# Altium schematic sheet APP_1_Power_m.SchDoc
size Tabloid; SheetNumber: 10; SheetTotal: 16; Sheet_Name: Power; Size: 11x17
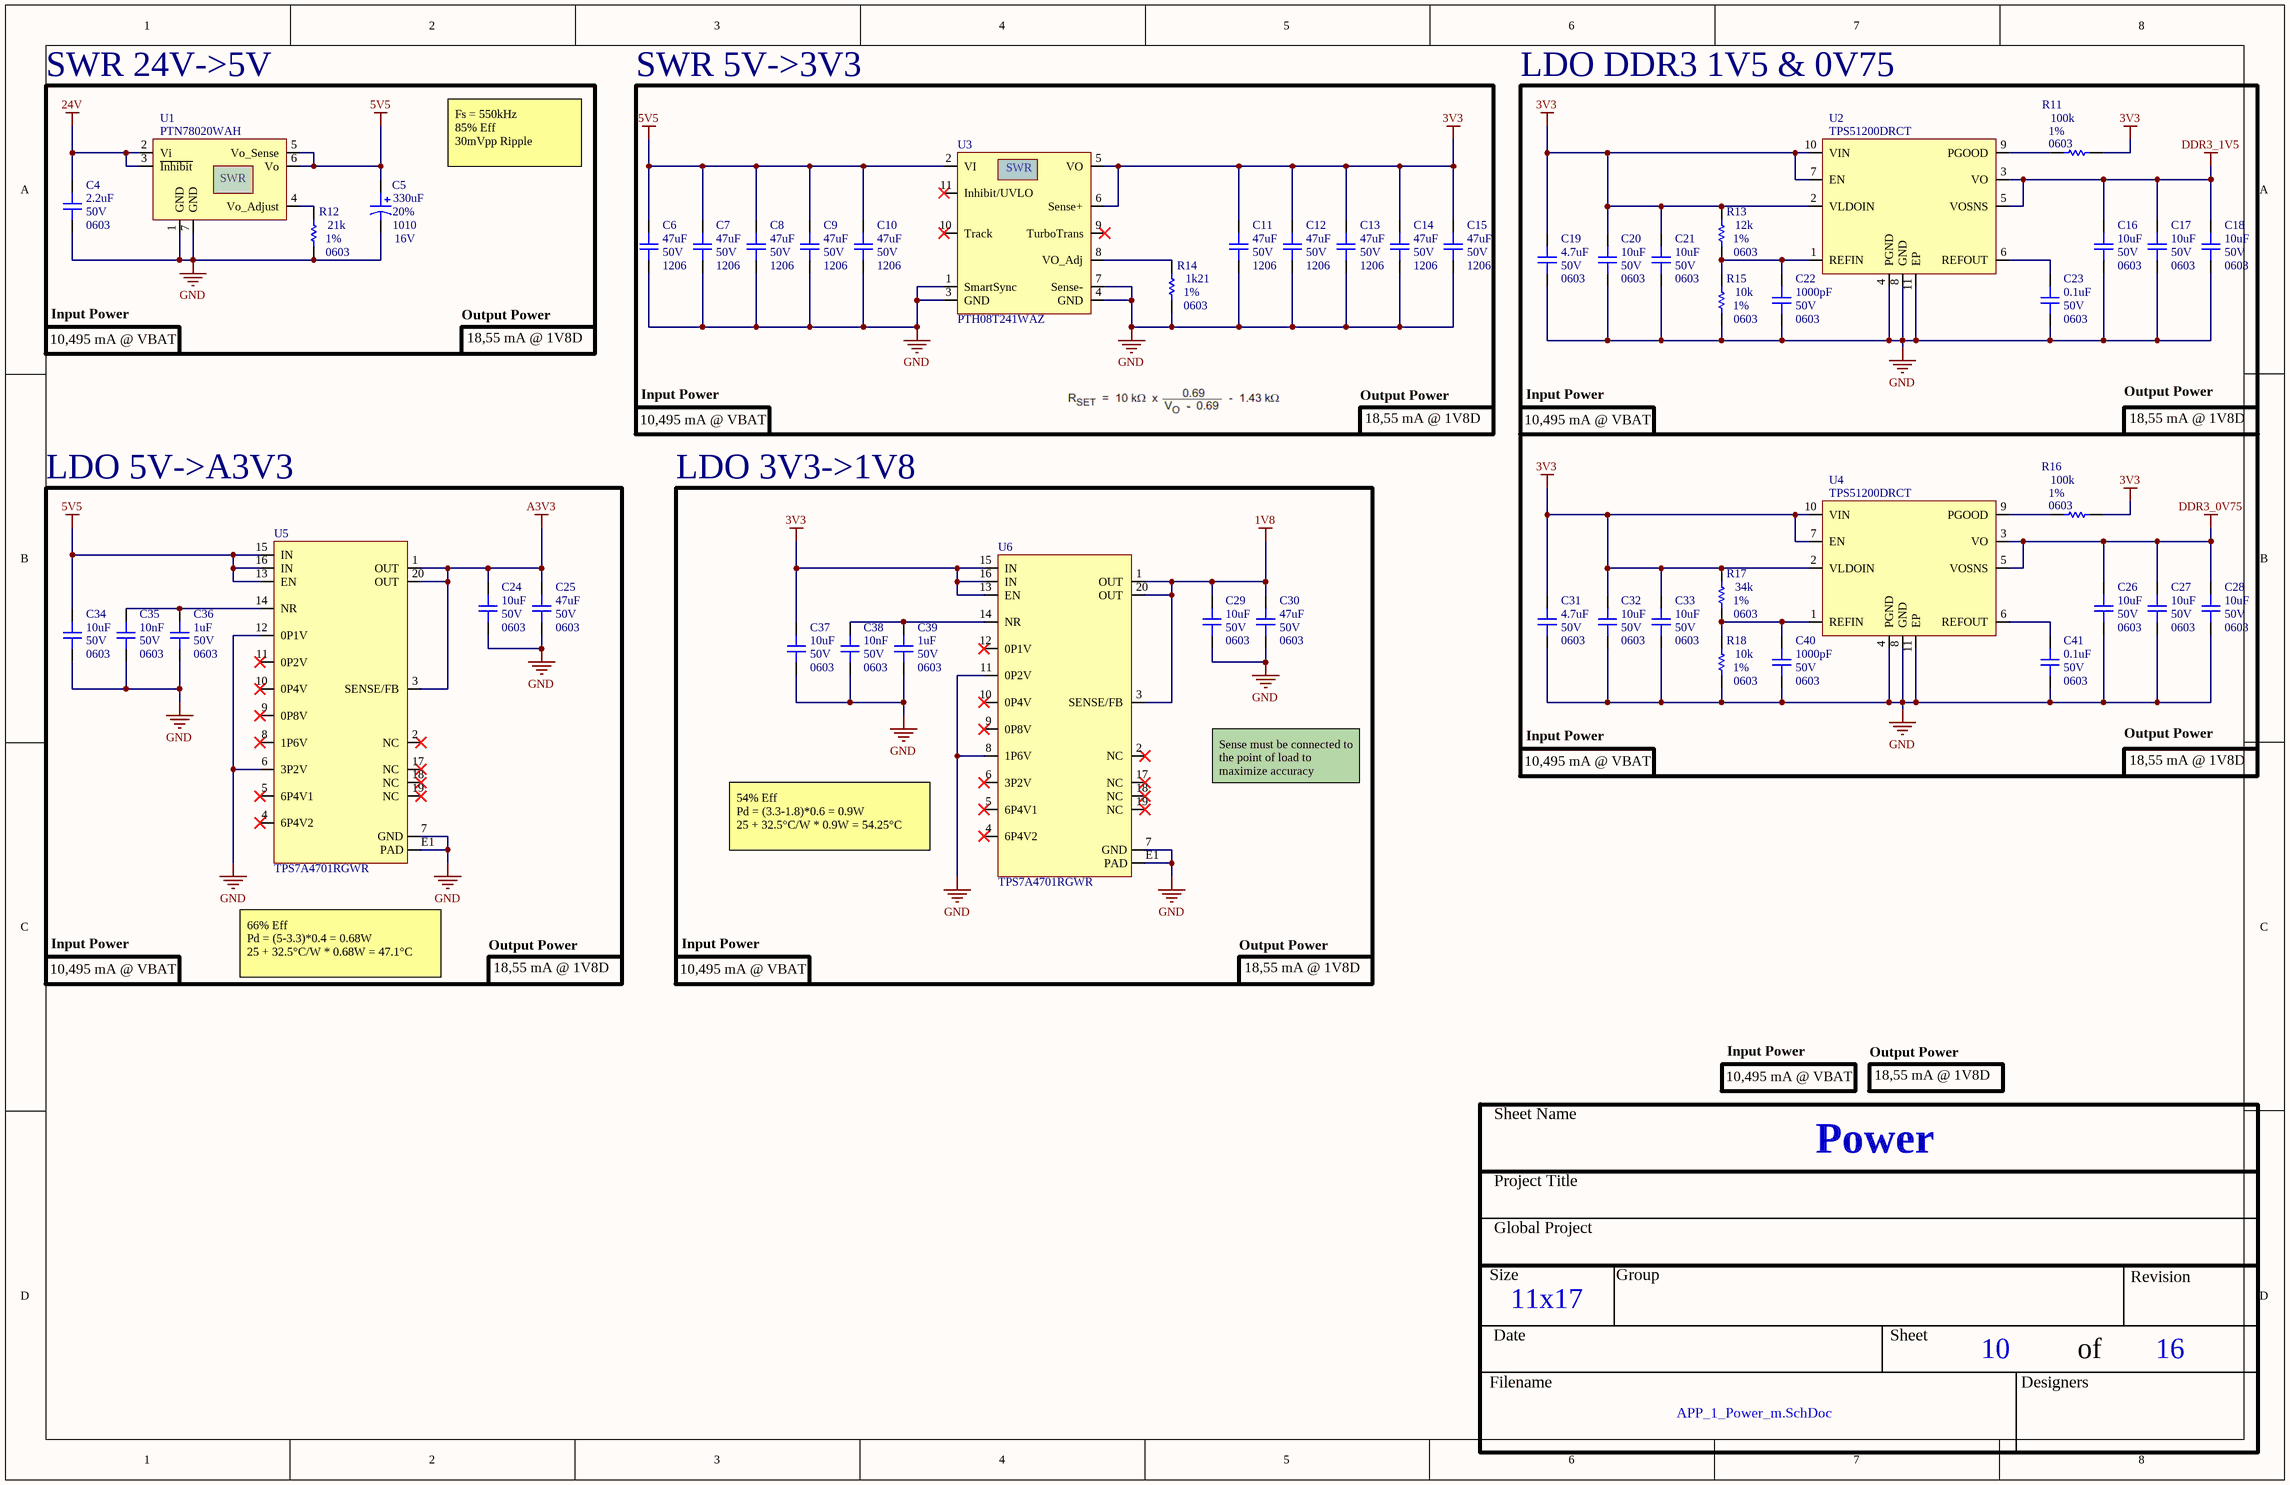
[diagram p0: APP_1_Power_m.SchDoc]

## Parts
C4  value 2.2uF  Voltage: 50V  Package: 0603  [CAP_0603]  (hidden comment: CAP - 0603)
C5  value 330uF  Voltage: 16V  Package: 1010  Precision: 20%  [CAP_ALU_1010_vishay]  (hidden comment: MAL214699501E3)
C6  value 47uF  Voltage: 50V  Package: 1206  [CAP_1206]  (hidden comment: CAP - 1206)
C7  value 47uF  Voltage: 50V  Package: 1206  [CAP_1206]  (hidden comment: CAP - 1206)
C8  value 47uF  Voltage: 50V  Package: 1206  [CAP_1206]  (hidden comment: CAP - 1206)
C9  value 47uF  Voltage: 50V  Package: 1206  [CAP_1206]  (hidden comment: CAP - 1206)
C10  value 47uF  Voltage: 50V  Package: 1206  [CAP_1206]  (hidden comment: CAP - 1206)
C11  value 47uF  Voltage: 50V  Package: 1206  [CAP_1206]  (hidden comment: CAP - 1206)
C12  value 47uF  Voltage: 50V  Package: 1206  [CAP_1206]  (hidden comment: CAP - 1206)
C13  value 47uF  Voltage: 50V  Package: 1206  [CAP_1206]  (hidden comment: CAP - 1206)
C14  value 47uF  Voltage: 50V  Package: 1206  [CAP_1206]  (hidden comment: CAP - 1206)
C15  value 47uF  Voltage: 50V  Package: 1206  [CAP_1206]  (hidden comment: CAP - 1206)
C16  value 10uF  Voltage: 50V  Package: 0603  [CAP_0603]  (hidden comment: CAP - 0603)
C17  value 10uF  Voltage: 50V  Package: 0603  [CAP_0603]  (hidden comment: CAP - 0603)
C18  value 10uF  Voltage: 50V  Package: 0603  [CAP_0603]  (hidden comment: CAP - 0603)
C19  value 4.7uF  Voltage: 50V  Package: 0603  [CAP_0603]  (hidden comment: CAP - 0603)
C20  value 10uF  Voltage: 50V  Package: 0603  [CAP_0603]  (hidden comment: CAP - 0603)
C21  value 10uF  Voltage: 50V  Package: 0603  [CAP_0603]  (hidden comment: CAP - 0603)
C22  value 1000pF  Voltage: 50V  Package: 0603  [CAP_0603]  (hidden comment: CAP - 0603)
C23  value 0.1uF  Voltage: 50V  Package: 0603  [CAP_0603]  (hidden comment: CAP - 0603)
C24  value 10uF  Voltage: 50V  Package: 0603  [CAP_0603]  (hidden comment: CAP - 0603)
C25  value 47uF  Voltage: 50V  Package: 0603  [CAP_0603]  (hidden comment: CAP - 0603)
C26  value 10uF  Voltage: 50V  Package: 0603  [CAP_0603]  (hidden comment: CAP - 0603)
C27  value 10uF  Voltage: 50V  Package: 0603  [CAP_0603]  (hidden comment: CAP - 0603)
C28  value 10uF  Voltage: 50V  Package: 0603  [CAP_0603]  (hidden comment: CAP - 0603)
C29  value 10uF  Voltage: 50V  Package: 0603  [CAP_0603]  (hidden comment: CAP - 0603)
C30  value 47uF  Voltage: 50V  Package: 0603  [CAP_0603]  (hidden comment: CAP - 0603)
C31  value 4.7uF  Voltage: 50V  Package: 0603  [CAP_0603]  (hidden comment: CAP - 0603)
C32  value 10uF  Voltage: 50V  Package: 0603  [CAP_0603]  (hidden comment: CAP - 0603)
C33  value 10uF  Voltage: 50V  Package: 0603  [CAP_0603]  (hidden comment: CAP - 0603)
C34  value 10uF  Voltage: 50V  Package: 0603  [CAP_0603]  (hidden comment: CAP - 0603)
C35  value 10nF  Voltage: 50V  Package: 0603  [CAP_0603]  (hidden comment: CAP - 0603)
C36  value 1uF  Voltage: 50V  Package: 0603  [CAP_0603]  (hidden comment: CAP - 0603)
C37  value 10uF  Voltage: 50V  Package: 0603  [CAP_0603]  (hidden comment: CAP - 0603)
C38  value 10nF  Voltage: 50V  Package: 0603  [CAP_0603]  (hidden comment: CAP - 0603)
C39  value 1uF  Voltage: 50V  Package: 0603  [CAP_0603]  (hidden comment: CAP - 0603)
C40  value 1000pF  Voltage: 50V  Package: 0603  [CAP_0603]  (hidden comment: CAP - 0603)
C41  value 0.1uF  Voltage: 50V  Package: 0603  [CAP_0603]  (hidden comment: CAP - 0603)
R11  value 100k  Package: 0603  Precision: 1%  [RES_0603]  (hidden comment: RES - 0603)
R12  value 21k  Package: 0603  Precision: 1%  [RES_0603]  (hidden comment: RES - 0603)
R13  value 12k  Package: 0603  Precision: 1%  [RES_0603]  (hidden comment: RES - 0603)
R14  value 1k21  Package: 0603  Precision: 1%  [RES_0603]  (hidden comment: RES - 0603)
R15  value 10k  Package: 0603  Precision: 1%  [RES_0603]  (hidden comment: RES - 0603)
R16  value 100k  Package: 0603  Precision: 1%  [RES_0603]  (hidden comment: RES - 0603)
R17  value 34k  Package: 0603  Precision: 1%  [RES_0603]  (hidden comment: RES - 0603)
R18  value 10k  Package: 0603  Precision: 1%  [RES_0603]  (hidden comment: RES - 0603)
U1  PTN78020WAH  [REG_SWR_PTN78020WAH]
U2  TPS51200DRCT  [REG_PMIC_TPS51200DRCT]
U3  PTH08T241WAZ  [REG_SWR_PTH08T241WAZ]
U4  TPS51200DRCT  [REG_PMIC_TPS51200DRCT]
U5  TPS7A4701RGWR  [REG_TPS7A4701RGWR]
U6  TPS7A4701RGWR  [REG_TPS7A4701RGWR]

## Blocks framed on the sheet
SWR 24V->5V: C4 C5 R12 U1
SWR 5V->3V3: C6-C15 R14 U3
LDO DDR3 1V5 & 0V75: C16-C23 C26-C28 C31-C33 C40 C41 R11 R13 R15-R18 U2 U4
LDO 5V->A3V3: C24 C25 C34-C36 U5
LDO 3V3->1V8: C29 C30 C37-C39 U6

## Nets
1V8: C29.2 C30.2 U6.1(OUT) U6.3(SENSE/FB) U6.20(OUT)
3V3: C11.2 C12.2 C13.2 C14.2 C15.2 C19.2 C20.2 C21.2 C31.2 C32.2 C33.2 C37.2 R11.2 R13.2 R16.2 R17.2 U2.2(VLDOIN) U2.7(EN) U2.10(VIN) U3.5(VO) U3.6(Sense+) U4.2(VLDOIN) U4.7(EN) U4.10(VIN) U6.13(EN) U6.15(IN) U6.16(IN)
5V5: C5.1 C6.2 C7.2 C8.2 C9.2 C10.2 C34.2 U1.5(Vo_Sense) U1.6(Vo) U3.2(VI) U5.13(EN) U5.15(IN) U5.16(IN)
24V: C4.2 U1.2(Vi) U1.3(~{Inhibit})
A3V3: C24.2 C25.2 U5.1(OUT) U5.3(SENSE/FB) U5.20(OUT)
DDR3_0V75: C26.2 C27.2 C28.2 U4.3(VO) U4.5(VOSNS)
DDR3_1V5: C16.2 C17.2 C18.2 U2.3(VO) U2.5(VOSNS)
GND: C4.1 C5.2 C6.1 C7.1 C8.1 C9.1 C10.1 C11.1 C12.1 C13.1 C14.1 C15.1 C16.1 C17.1 C18.1 C19.1 C20.1 C21.1 C22.1 C23.1 C24.1 C25.1 C26.1 C27.1 C28.1 C29.1 C30.1 C31.1 C32.1 C33.1 C34.1 C35.1 C36.1 C37.1 C38.1 C39.1 C40.1 C41.1 R12.1 R14.1 R15.1 R18.1 U1.1(GND) U1.7(GND) U2.4(PGND) U2.8(GND) U2.11(EP) U3.1(SmartSync) U3.3(GND) U3.4(GND) U3.7(Sense-) U4.4(PGND) U4.8(GND) U4.11(EP) U5.6(3P2V) U5.7(GND) U5.12(0P1V) U5.E1(PAD) U6.7(GND) U6.8(1P6V) U6.11(0P2V) U6.E1(PAD)
NetC22_2: C22.2 R13.1 R15.2 U2.1(REFIN)
NetC23_2: C23.2 U2.6(REFOUT)
NetC35_2: C35.2 C36.2 U5.14(NR)
NetC38_2: C38.2 C39.2 U6.14(NR)
NetC40_2: C40.2 R17.1 R18.2 U4.1(REFIN)
NetC41_2: C41.2 U4.6(REFOUT)
NetR11_1: R11.1 U2.9(PGOOD)
NetR12_2: R12.2 U1.4(Vo_Adjust)
NetR14_2: R14.2 U3.8(VO_Adj)
NetR16_1: R16.1 U4.9(PGOOD)

Not connected (* = marked no-connect by the designer): U3 9(TurboTrans)* 10(Track)* 11(Inhibit/UVLO)*; U5 2(NC)* 4(6P4V2)* 5(6P4V1)* 8(1P6V)* 9(0P8V)* 10(0P4V)* 11(0P2V)* 17(NC)* 18(NC)* 19(NC)*; U6 2(NC)* 4(6P4V2)* 5(6P4V1)* 6(3P2V)* 9(0P8V)* 10(0P4V)* 12(0P1V)* 17(NC)* 18(NC)* 19(NC)*

## Notes on the sheet
- Fs = 550kHz
  85% Eff
  30mVpp Ripple
- 10,495 mA @ VBAT
- Input Power
- Output Power
- 18,55 mA @ 1V8D
- Sense must be connected to the point of load to maximize accuracy
- 54% Eff
  Pd = (3.3-1.8)*0.6 = 0.9W
  25 + 32.5°C/W * 0.9W = 54.25°C
- 66% Eff
  Pd = (5-3.3)*0.4 = 0.68W
  25 + 32.5°C/W * 0.68W = 47.1°C
- Sheet Name
- Project Title
- Global Project
- Size
- Group
- Revision
- Date
- Sheet
- of
- Filename
- Designers
- (in symbol REG_SWR_PTH08T241WAZ) SWR
- (in symbol REG_SWR_PTN78020WAH) SWR

## Library data of the parts
C4 C16-C41 = CAP - 0603: Precision: 10%; Current: *; CreatedBy: Jonathan Bouchard; Power: *
C5 = CAP_ALU_MAL214699501E3: CAP - ALU 330uF 20% 16V - 1010; Current: 750mA; Mfg: Vishay Dale; Mfg Part Number: MAL214699501E3; HelpURL: http://www.vishay.com/docs/28403/146cti.pdf; CreatedBy: Jonathan Bouchard; Temperature: -55°C to 125°C; Power: *; Supplier 1: Digikey; Supplier Part Number 1: 4405PHCT-ND
C6-C15 = CAP - 1206: Precision: 10%; Current: *; CreatedBy: Jonathan Bouchard; Power: *
U1 = REG_SWR_PTN78020WAH: REG - DC DC CONVERTER 2.5-12.6V 6A - TH; Manufacturer #1: Texas Instruments; Value: 7V ~ 36V -> 2.5 ~ 12.6V; Voltage Rating: 36V; Power Max: 90 W; GRAMS Lib Spec: 2.8; Magnetic Material: Yes; Cryo: UNKNOWN; Tolerance: -; Current Rating: 6A; HelpURL: http://www.ti.com/lit/ds/symlink/ptn78020h.pdf; CreatedBy/Date: Arnaud_Samson_2019-07-09; VerifiedBy: c.Paulin - 15 juillet 2019; Temperature: -40°C ~ 85°C; Package: TH; Manufacturer #2: -; Assembly Type: TH; Part Number #2: -; Part Number #1: PTN78020WAH; Polarized: Yes; Supplier 1: Digi-Key; Supplier Part Number 1: 296-20515-ND
U2 U4 = REG_PMIC_TPS51200DRCT: REG - DDR TERMINATION/REF REG - 10-VFDFN; Manufacturer #1: Texas Instruments; Value: DDR, DDR2, DDR3(L), DDR4; Voltage Rating: 2.375V ~ 3.5V; Current Rating: Source: 3A~4.5A, Sink: 3.5A~5.5A; GRAMS Lib Spec: 2.8; Magnetic Material: Unknown; Polarized: Yes; Tolerance: *; Power Max: *; HelpURL: http://www.ti.com/lit/ds/symlink/tps51200.pdf; CreatedBy/Date: Joel Lemay 2019-03-19; VerifiedBy: Nicolas V. (2019-05-31); Temperature: -40°C ~ 85°C; Package: 10-VFDFN; Manufacturer #2: *; Note: *; Assembly Type: SMD; Part Number #2: *; Part Number #1: TPS51200DRCT; Supplier 1: Digi-Key; Supplier Part Number 1: 296-23830-1-ND; Cryo: UNKNOWN
U3 = REG_SWR_PTH08T241WAZ: REG - MODULE PIP 10A 14VIN - 11-SMD; Manufacturer #1: Texas Instruments; Current Rating: 10A (out); Voltage rating: 4.5-14V (Input), 0.69 - 5.5V (Out); Polarized: Yes; Magnetic Material: UNKNOWN; Manufacturer #2: *; Note: *; Power Max: *; Value: *; Part Number #1: PTH08T241WAZ; Part Number #2: *; HelpURL: http://www.ti.com/lit/ds/symlink/pth08t241w.pdf; Supplier 1: Digi-Key; Supplier Part Number 1: 296-21339-ND; Assembly Type: SMD; Temperature: -40°C ~ 85°C; Package: SMD; CreatedBy/Date: Olivier Bernard / 6/5/2018; VerifiedBy: Caroline Paulin / 10 juillet 2018; Cryo: UNKNOWN
U5 U6 = REG_LDO_TPS7A4701RGWR: REG - LINEAR POS ADJ 1A - 20VQFN; Manufacturer #1: Texas Instruments; GRAMS Lib Spec: 2.8; Magnetic Material: Unknown; Polarized: Yes; Value: 1.4 à 34V; Voltage rating: 35V max; Assembly Type: SMD; CreatedBy/Date: L-P Gauthier / 2018-05-29; Current Rating: 1A; Manufacturer #2: TBD; Part Number #1: TPS7A4701RGWR; Part Number #2: TBD; Package: 20-VQFN Exposed Pad; Power Max: *; Tolerance: -; Supplier 1: Digi-Key; Supplier Part Number 1: 296-37224-1-ND; VerifiedBy: Caroline Paulin - 28 sept 2018; Temperature: -40°C ~ 125°C; HelpURL: http://www.ti.com/lit/ds/symlink/tps7a47.pdf; Cryo: UNKNOWN
R11-R18 = RES - 0603: Current: *; CreatedBy: Jonathan Bouchard